# EAGLE schematic MainBoard_V1.01 (EAGLE 9.2.2)
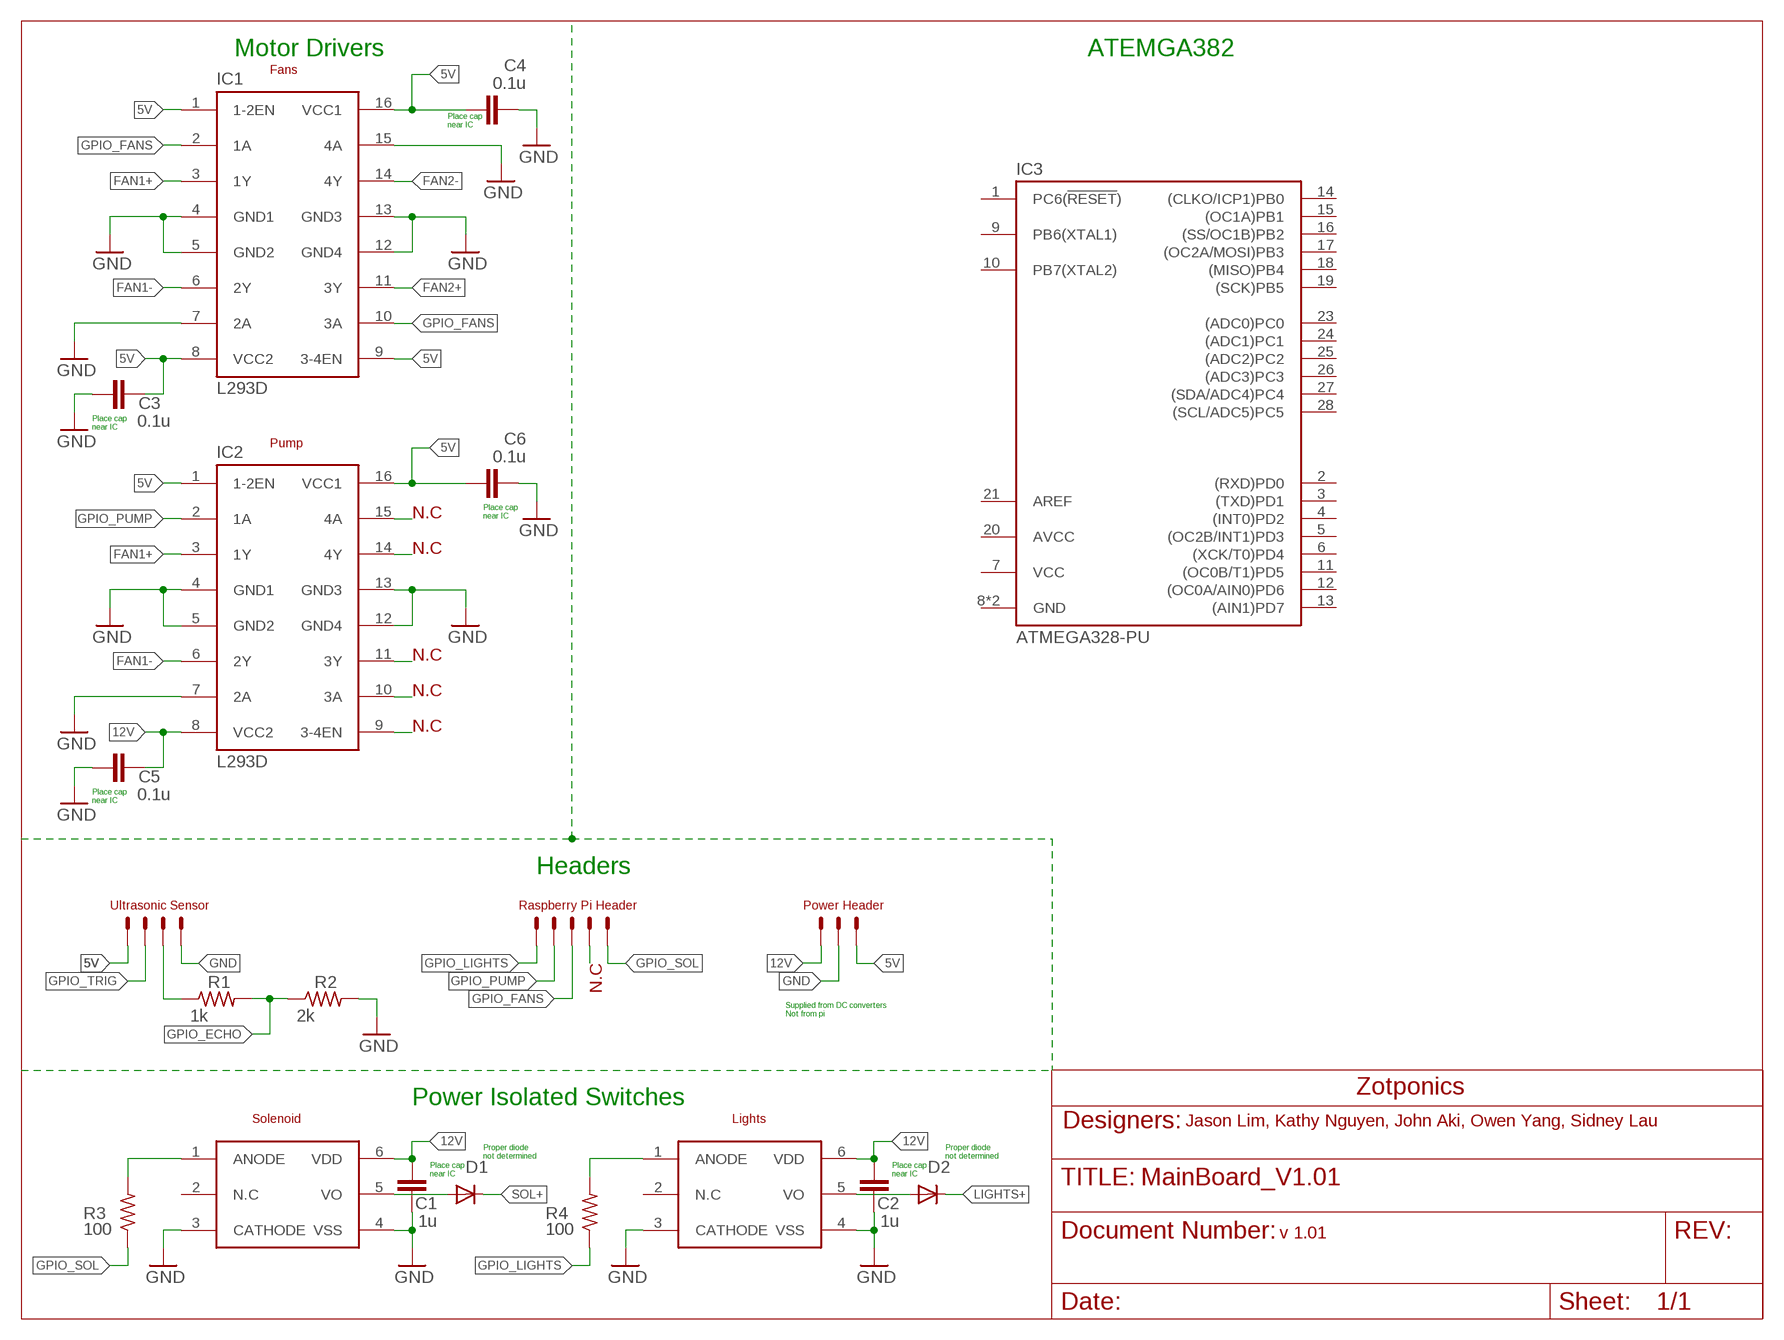
[diagram p0: schematic, sheet 1]

## Parts
C1  1u  C2,5-3  [C2.5-3]
C2  1u  C2,5-3  [C2.5-3]
C3  0.1u  C2,5-3  [C2.5-3]
C4  0.1u  C2,5-3  [C2.5-3]
C5  0.1u  C2,5-3  [C2.5-3]
C6  0.1u  C2,5-3  [C2.5-3]
D1  1N4004  [DO41-10]
D2  1N4004  [DO41-10]
IC1  L293D  [DIL16]
IC2  L293D  [DIL16]
IC3  ATMEGA328-PU  [DIL28]
R1  1k  R-US_0204/2V  [0204V]
R2  2k  R-US_0204/2V  [0204V]
R3  100  R-US_0204/2V  [0204V]
R4  100  R-US_0204/2V  [0204V]
U$1  FOD8343  [FOD8343]
U$3  FOD8343  [FOD8343]
X1  JST-XH-04-PIN-ROUND-PAD  [JST-XH-04-PACKAGE-ROUND-PAD]
X2  JST-XH-05-PIN-ROUND-PAD  [JST-XH-05-PACKAGE-ROUND-PAD]
X3  JST-XH-03-PIN-ROUND-PAD  [JST-XH-03-PACKAGE-ROUND-PAD]

## Nets
5V: C3.2 C4.1 C6.1 IC1.1(1-2EN) IC1.8(VCC2) IC1.9(3-4EN) IC1.16(VCC1) IC2.1(1-2EN) IC2.9(3-4EN) IC2.16(VCC1) X1.1 X3.3
12V: C1.2 C2.2 C5.2 IC2.8(VCC2) U$1.6(VDD) U$3.6(VDD) X3.1
FAN1+: IC1.3(1Y) IC2.3(1Y)
FAN1-: IC1.6(2Y) IC2.6(2Y)
FAN2+: IC1.11(3Y) IC2.11(3Y)
FAN2-: IC1.14(4Y) IC2.14(4Y)
GND: C1.1 C2.1 C3.1 C4.2 C5.1 C6.2 IC1.4(GND1) IC1.5(GND2) IC1.7(2A) IC1.12(GND4) IC1.13(GND3) IC2.4(GND1) IC2.5(GND2) IC2.7(2A) IC2.12(GND4) IC2.13(GND3) R2.2 U$1.3(CATHODE) U$1.4(VSS) U$3.3(CATHODE) U$3.4(VSS) X1.4 X3.2
GPIO_ECHO: R1.2 R2.1
GPIO_FANS: IC1.2(1A) IC1.10(3A) IC2.10(3A) X2.3
GPIO_LIGHTS: R4.1 X2.1
GPIO_PUMP: IC2.2(1A) X2.2
GPIO_SOL: R3.1 X2.5
GPIO_TRIG: X1.2
LIGHTS+: D2.C
N$1: R3.2 U$3.1(ANODE)
N$2: D2.A U$1.5(VO)
N$3: D1.A U$3.5(VO)
N$4: IC1.15(4A) ; supply symbol labelled GND
N$5: R4.2 U$1.1(ANODE)
N$6: IC2.15(4A)
N$8: X2.4
N$9: R1.1 X1.3
SOL+: D1.C
Unconnected: IC3.1(PC6(!RESET!)) IC3.2((RXD)PD0) IC3.3((TXD)PD1) IC3.4((INT0)PD2) IC3.5((OC2B/INT1)PD3) IC3.6((XCK/T0)PD4) IC3.9(PB6(XTAL1)) IC3.10(PB7(XTAL2)) IC3.11((OC0B/T1)PD5) IC3.12((OC0A/AIN0)PD6) IC3.13((AIN1)PD7) IC3.14((CLKO/ICP1)PB0) IC3.15((OC1A)PB1) IC3.16((SS/OC1B)PB2) IC3.17((OC2A/MOSI)PB3) IC3.18((MISO)PB4) IC3.19((SCK)PB5) IC3.21(AREF) IC3.23((ADC0)PC0) IC3.24((ADC1)PC1) IC3.25((ADC2)PC2) IC3.26((ADC3)PC3) IC3.27((SDA/ADC4)PC4) IC3.28((SCL/ADC5)PC5) U$1.2(N.C) U$3.2(N.C)

## Notes on the sheet
- Motor Drivers | ATEMGA382
- Fans
- Place cap
  near IC
- Place cap
  near IC
- Pump
- N.C
- Place cap
  near IC
- N.C
- N.C
- N.C
- N.C
- Place cap
  near IC
- Headers
- Ultrasonic Sensor | Raspberry Pi Header | Power Header
- N.C
- Supplied from DC converters
  Not from pi
- Zotponics
- Power Isolated Switches
- Solenoid | Lights | Jason Lim, Kathy Nguyen, John Aki, Owen Yang, Sidney Lau
- Designers:
- Proper diode
  not determined
- Proper diode
  not determined
- Place cap
  near IC
- Place cap
  near IC
- v 1.01

## Power pins joined to a net without a drawn wire
AVCC: IC3.20(AVCC)
GND: IC3.8(GND) IC3.22(GND)
VCC: IC3.7(VCC)

## Library data of the parts
C1-C6 = capacitor-wima:C: CAPACITOR naming: grid - package width
D1 D2 = adafruit:1N4004: DIODE General purpose 1N400x type rectifier (With bigger pads) http://www.ladyada.net/library/pcb/eaglelibrary.html
IC1 IC2 = st-microelectronics:L293D: PUSH-PULL 4 CHANNEL DRIVER; MPN: L293D; OC_FARNELL: 9589619; OC_NEWARK: 56P8249
IC3 = ATMEGA328-PU:ATMEGA328-PU: Atmel ATmega48/88/168/328 AVR Microcontroller; AVAILABILITY: Unavailable; DESCRIPTION: AVR AVR® ATmega Microcontroller IC 8-Bit 20MHz 32KB _16K x 16_ FLASH 28-PDIP; MF: Microchip Technology; MP: ATMEGA328-PU; PACKAGE: DIP-28 Microchip Technology; PRICE: None
R1-R4 = resistor:R-US_: RESISTOR, American symbol
U$1 U$3 = Zotponics:FOD8343
X1 = Rembrandt Electronics - JST XH Connectors v1-0:JST-XH-04-PIN: JST XH Connector 2 Pin Wire to board connector. Pitch: 2,54 mm, (0.100") Number of pins: 4 Created by Rembrandt Electronics www.rembrandtelectronics.com
X2 = Rembrandt Electronics - JST XH Connectors v1-0:JST-XH-05-PIN: JST XH Connector 2 Pin Wire to board connector. Pitch: 2,54 mm, (0.100") Number of pins: 5 Created by Rembrandt Electronics www.rembrandtelectronics.com
X3 = Rembrandt Electronics - JST XH Connectors v1-0:JST-XH-03-PIN: JST XH Connector 2 Pin Wire to board connector. Pitch: 2,54 mm, (0.100") Number of pins: 3 Created by Rembrandt Electronics www.rembrandtelectronics.com